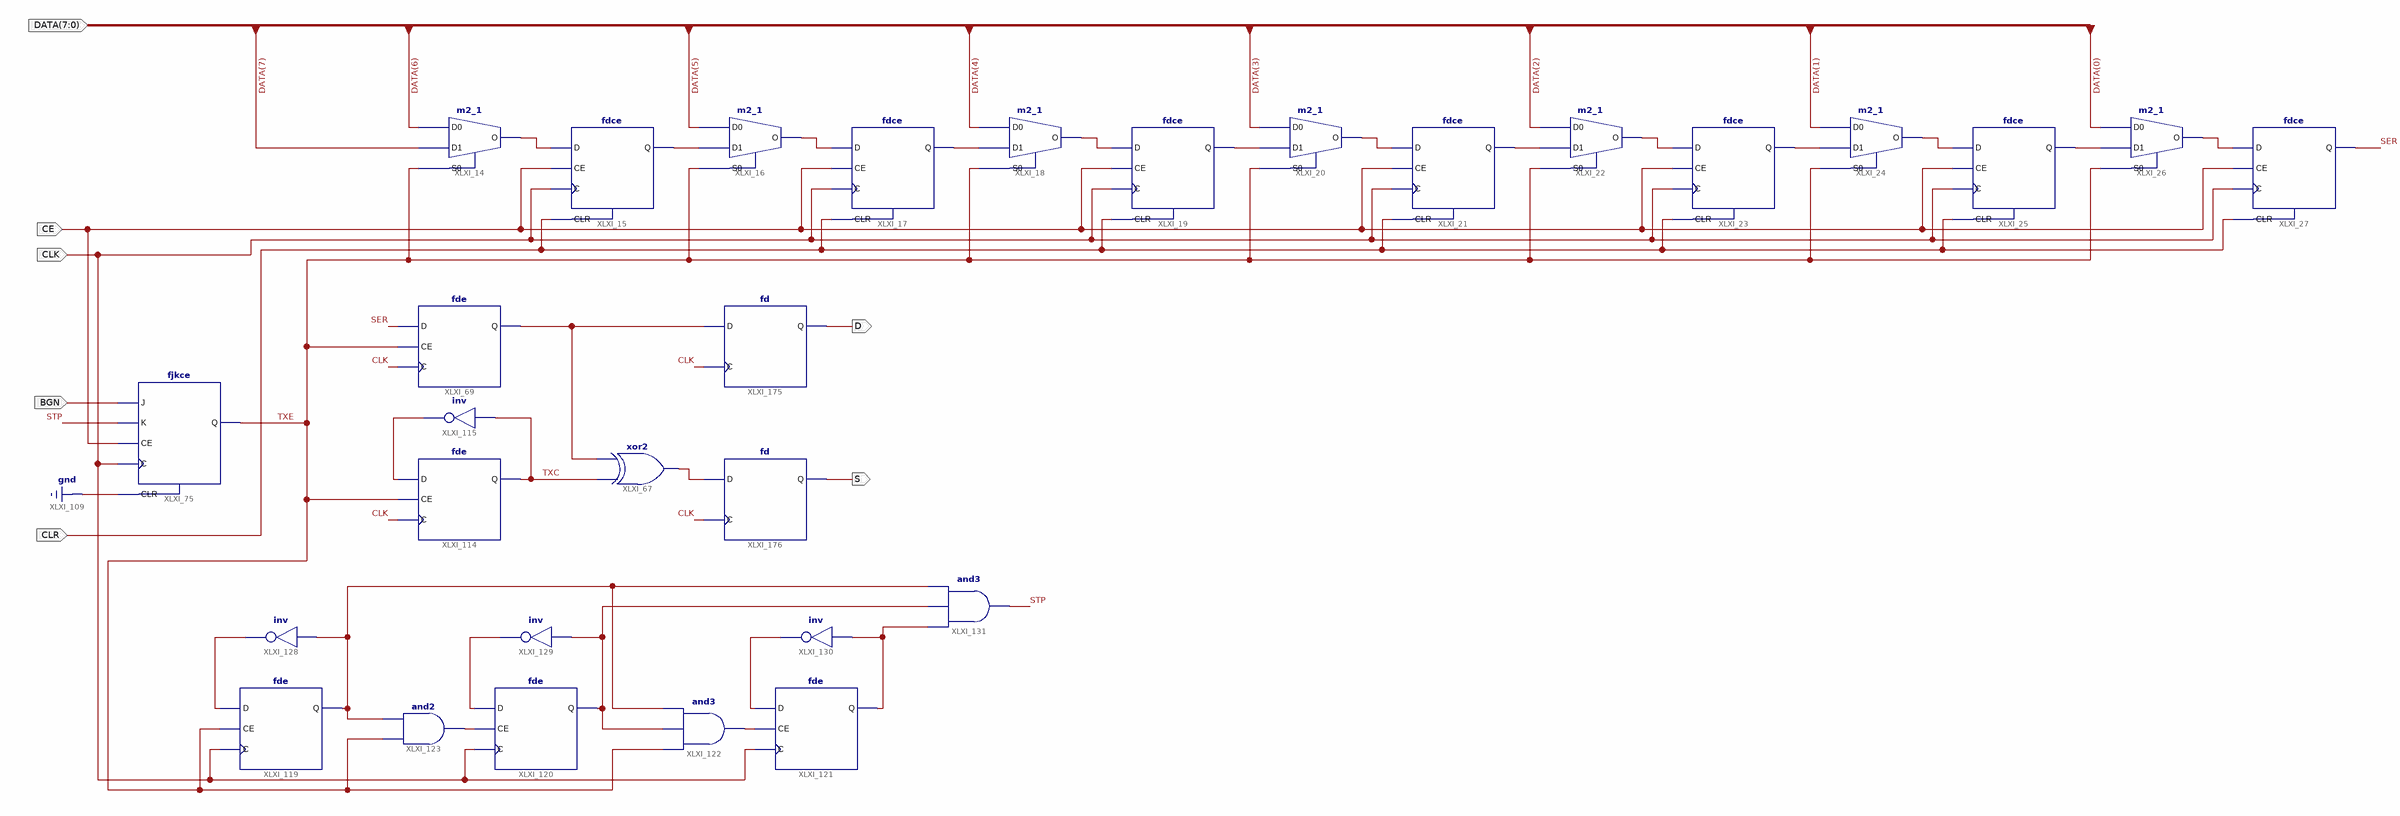
[diagram p0: schematic sheet 1]
// Xilinx ISE schematic transmitter.sch (spartan6) as structural Verilog: 30 symbols, 7 ports
module transmitter (
  input  CLK,
  input  [7:0] DATA,
  input  CE,
  input  BGN,
  input  CLR,
  output D,
  output S
);

  wire SER, STP, TXC, TXE, XLXN_11, XLXN_14, XLXN_17, XLXN_19, XLXN_21, XLXN_23, XLXN_25, XLXN_27, XLXN_29,
       XLXN_31, XLXN_33, XLXN_35, XLXN_39, XLXN_228, XLXN_284, XLXN_285, XLXN_287, XLXN_289, XLXN_291,
       XLXN_292, XLXN_301, XLXN_304, XLXN_313, XLXN_410;

  fjkce XLXI_75 (.C(CLK), .CE(CE), .CLR(1'b0), .J(BGN), .K(STP), .Q(TXE));
  fdce XLXI_15 (.C(CLK), .CE(CE), .CLR(CLR), .D(XLXN_14), .Q(XLXN_11));
  m2_1 XLXI_16 (.D0(DATA[5]), .D1(XLXN_11), .S0(TXE), .O(XLXN_19));
  fdce XLXI_17 (.C(CLK), .CE(CE), .CLR(CLR), .D(XLXN_19), .Q(XLXN_17));
  m2_1 XLXI_18 (.D0(DATA[4]), .D1(XLXN_17), .S0(TXE), .O(XLXN_23));
  fdce XLXI_19 (.C(CLK), .CE(CE), .CLR(CLR), .D(XLXN_23), .Q(XLXN_21));
  m2_1 XLXI_20 (.D0(DATA[3]), .D1(XLXN_21), .S0(TXE), .O(XLXN_27));
  fdce XLXI_21 (.C(CLK), .CE(CE), .CLR(CLR), .D(XLXN_27), .Q(XLXN_25));
  m2_1 XLXI_22 (.D0(DATA[2]), .D1(XLXN_25), .S0(TXE), .O(XLXN_31));
  fdce XLXI_23 (.C(CLK), .CE(CE), .CLR(CLR), .D(XLXN_31), .Q(XLXN_29));
  m2_1 XLXI_24 (.D0(DATA[1]), .D1(XLXN_29), .S0(TXE), .O(XLXN_35));
  fdce XLXI_25 (.C(CLK), .CE(CE), .CLR(CLR), .D(XLXN_35), .Q(XLXN_33));
  m2_1 XLXI_26 (.D0(DATA[0]), .D1(XLXN_33), .S0(TXE), .O(XLXN_39));
  fdce XLXI_27 (.C(CLK), .CE(CE), .CLR(CLR), .D(XLXN_39), .Q(SER));
  m2_1 XLXI_14 (.D0(DATA[6]), .D1(DATA[7]), .S0(TXE), .O(XLXN_14));
  fde XLXI_69 (.C(CLK), .CE(TXE), .D(SER), .Q(XLXN_313));
  fde XLXI_114 (.C(CLK), .CE(TXE), .D(XLXN_228), .Q(TXC));
  not XLXI_115 (XLXN_228, TXC);
  xor XLXI_67 (XLXN_410, TXC, XLXN_313);
  fde XLXI_119 (.C(CLK), .CE(TXE), .D(XLXN_287), .Q(XLXN_304));
  fde XLXI_120 (.C(CLK), .CE(XLXN_284), .D(XLXN_289), .Q(XLXN_301));
  and XLXI_123 (XLXN_284, TXE, XLXN_304);
  fde XLXI_121 (.C(CLK), .CE(XLXN_285), .D(XLXN_291), .Q(XLXN_292));
  not XLXI_128 (XLXN_287, XLXN_304);
  not XLXI_129 (XLXN_289, XLXN_301);
  not XLXI_130 (XLXN_291, XLXN_292);
  and XLXI_122 (XLXN_285, TXE, XLXN_301, XLXN_304);
  and XLXI_131 (STP, XLXN_292, XLXN_301, XLXN_304);
  fd XLXI_175 (.C(CLK), .D(XLXN_313), .Q(D));
  fd XLXI_176 (.C(CLK), .D(XLXN_410), .Q(S));
endmodule
